# Altium project 10.08.2025.PrjPcb
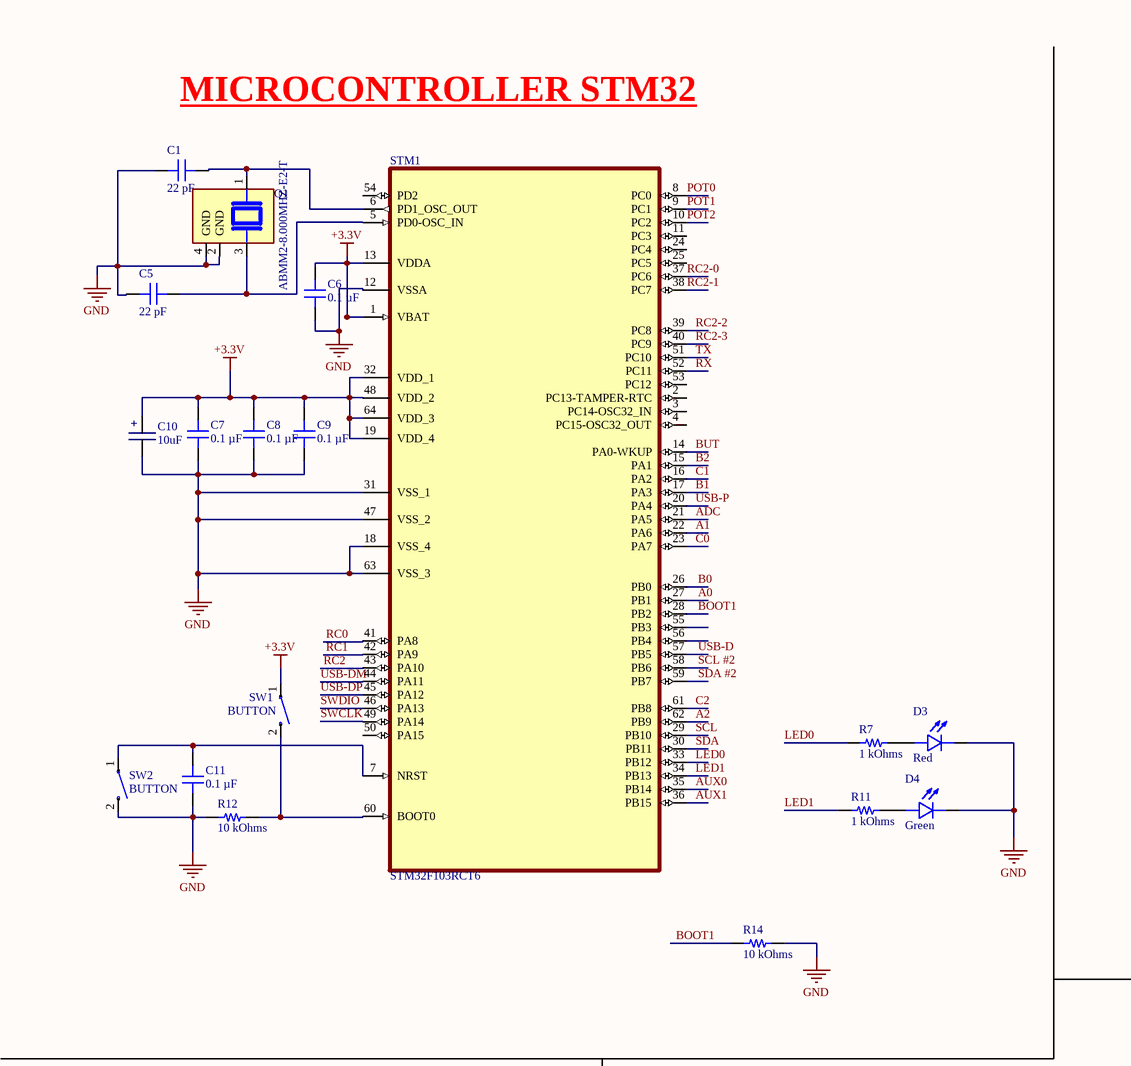
[diagram p0: Sheet2.SchDoc, top left]
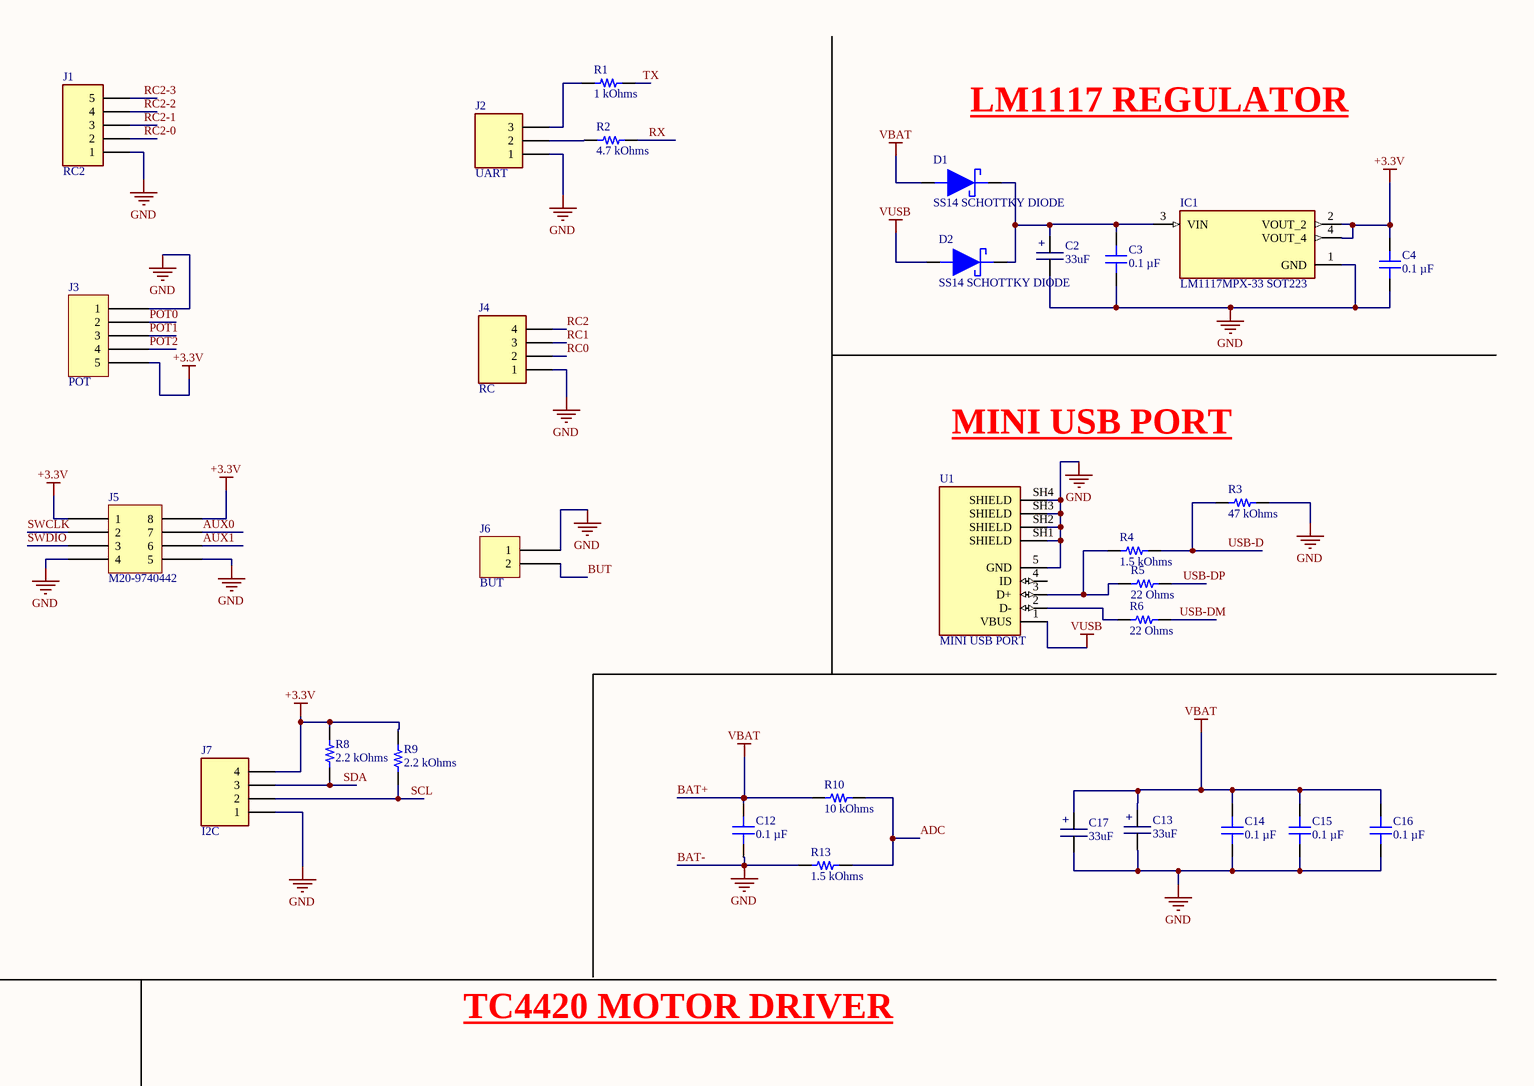
[diagram p1: Sheet2.SchDoc, top right]
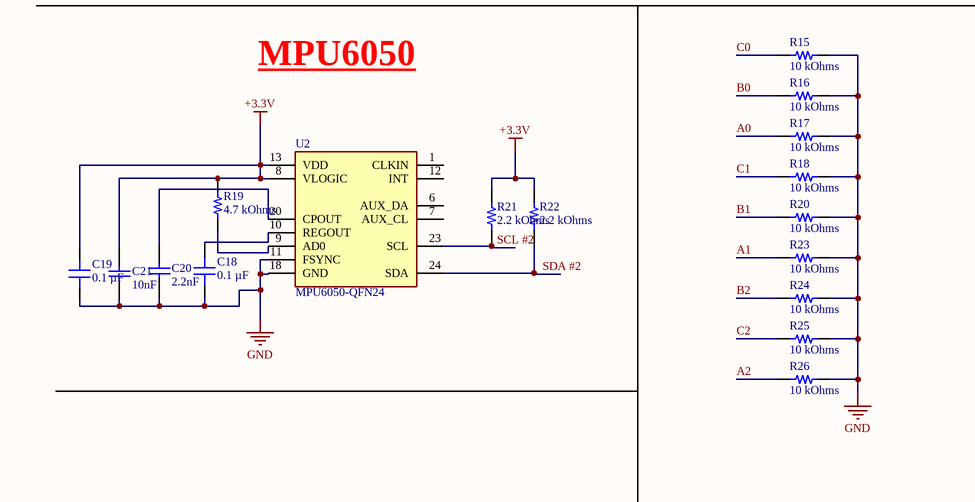
[diagram p2: Sheet2.SchDoc, bottom left]
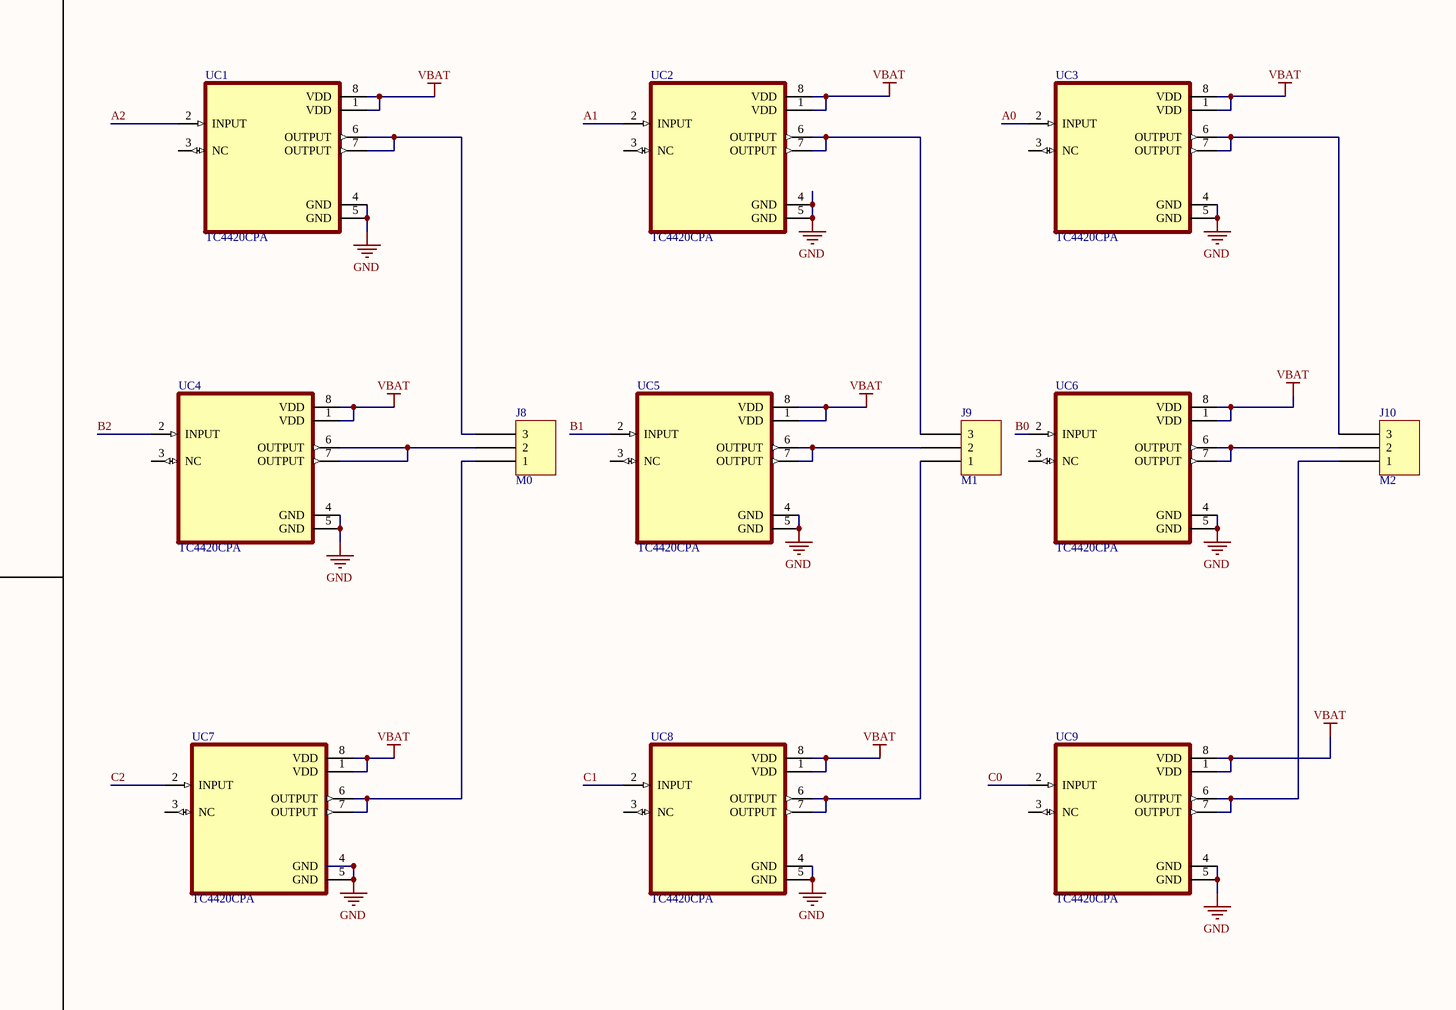
[diagram p3: Sheet2.SchDoc, bottom right]
1 sheet, 77 parts. Net scope: global (net labels, ports and power ports of the same name join across sheets).
Board file: PCB2.PcbDoc

## Sheet Sheet2.SchDoc
size 500 x 400 mm; SheetNumber: 1; SheetTotal: 1

### Parts
C1  22 pF  [CAP 1206_3216 - 0.8MM]
C2  33uF  [TANTAL CAP C-CASE]
C3  0.1 µF  [CAP 1206_3216 - 0.8MM]
C4  0.1 µF  [CAP 1206_3216 - 0.8MM]
C5  22 pF  [CAP 1206_3216 - 0.8MM]
C6  0.1 µF  [CAP 1206_3216 - 0.8MM]
C7  0.1 µF  [CAP 1206_3216 - 0.8MM]
C8  0.1 µF  [CAP 1206_3216 - 0.8MM]
C9  0.1 µF  [CAP 1206_3216 - 0.8MM]
C10  10uF  [TANTALUM SMD B]
C11  0.1 µF  [CAP 1206_3216 - 0.8MM]
C12  0.1 µF  [CAP 1206_3216 - 0.8MM]
C13  33uF  [TANTAL CAP C-CASE]
C14  0.1 µF  [CAP 1206_3216 - 0.8MM]
C15  0.1 µF  [CAP 1206_3216 - 0.8MM]
C16  0.1 µF  [CAP 1206_3216 - 0.8MM]
C17  33uF  [TANTAL CAP C-CASE]
C18  0.1 µF  [CAP 1206_3216 - 0.8MM]
C19  0.1 µF  [CAP 1206_3216 - 0.8MM]
C20  value 2.2nF  [CAP1206]  (hidden comment: CAP)
C21  value 10nF  [CAP1206]  (hidden comment: CAP)
D1  SS14 SCHOTTKY DIODE  [SS14 SCHOTTKY DIODE]
D2  SS14 SCHOTTKY DIODE  [SS14 SCHOTTKY DIODE]
D3  Red  [LEDC3216X120N]
D4  Green  [LEDC3216X120N]
IC1  LM1117MPX-33 SOT223  [LM1117MPX-33 SOT223]
J1  RC2  [header 5x1]
J2  UART  [HEADER 3PIN]
J3  POT  [HARWIN M20-9960545]
J4  RC  [Header 4pin]
J5  M20-9740442  [HARWIN M20-9740445]
J6  BUT  [HARWIN M20-9960245]
J7  I2C  [Header 4pin]
J8  M0  [HARWIN M20-9960345]
J9  M1  [HARWIN M20-9960345]
J10  M2  [HARWIN M20-9960345]
Q1  ABMM2-8.000MHZ-E2-T  [ABMM2-8.000MHZ-E2-T]
R1  1 kOhms  [RES 1206_3216]
R2  4.7 kOhms  [RES 1206_3216]
R3  47 kOhms  [YAGEO RES 1206_3216]
R4  1.5 kOhms  [RES 1206_3216]
R5  22 Ohms  [YAGEO RES 1206_3216]
R6  22 Ohms  [YAGEO RES 1206_3216]
R7  1 kOhms  [RES 1206_3216]
R8  2.2 kOhms  [YAGEO RES 1206_3216]
R9  2.2 kOhms  [YAGEO RES 1206_3216]
R10  10 kOhms  [RES 1206_3216]
R11  1 kOhms  [RES 1206_3216]
R12  10 kOhms  [RES 1206_3216]
R13  1.5 kOhms  [RES 1206_3216]
R14  10 kOhms  [RES 1206_3216]
R15  10 kOhms  [RES 1206_3216]
R16  10 kOhms  [RES 1206_3216]
R17  10 kOhms  [RES 1206_3216]
R18  10 kOhms  [RES 1206_3216]
R19  4.7 kOhms  [RES 1206_3216]
R20  10 kOhms  [RES 1206_3216]
R21  2.2 kOhms  [YAGEO RES 1206_3216]
R22  2.2 kOhms  [YAGEO RES 1206_3216]
R23  10 kOhms  [RES 1206_3216]
R24  10 kOhms  [RES 1206_3216]
R25  10 kOhms  [RES 1206_3216]
R26  10 kOhms  [RES 1206_3216]
STM1  STM32F103RCT6  [STM32F103RCT6]
SW1  BUTTON  [SW_1437566-3]
SW2  BUTTON  [SW_1437566-3]
U1  MINI USB PORT  [MINI USB PORT]
U2  MPU6050-QFN24  [MPU6050-QFN24]
UC1  TC4420CPA  [TC4420CPA]
UC2  TC4420CPA  [TC4420CPA]
UC3  TC4420CPA  [TC4420CPA]
UC4  TC4420CPA  [TC4420CPA]
UC5  TC4420CPA  [TC4420CPA]
UC6  TC4420CPA  [TC4420CPA]
UC7  TC4420CPA  [TC4420CPA]
UC8  TC4420CPA  [TC4420CPA]
UC9  TC4420CPA  [TC4420CPA]

### Nets
+3.3V: C4.1 C6.1 C7.1 C8.1 C9.1 C10.2 C19.1 C21.2 IC1.2(VOUT_2) IC1.4(VOUT_4) J3.5 J5.1 J5.8 J7.04(4) R8.1 R9.2 R19.1 R21.1 R22.1 STM1.1(VBAT) STM1.13(VDDA) STM1.19(VDD_4) STM1.32(VDD_1) STM1.48(VDD_2) STM1.64(VDD_3) SW1.1 U2.8(VLOGIC) U2.13(VDD)
BAT+: C12.1 C13.2 C14.1 C15.1 C16.1 C17.2 D1.2(A) R10.1 UC1.1(VDD) UC1.8(VDD) UC2.1(VDD) UC2.8(VDD) UC3.1(VDD) UC3.8(VDD) UC4.1(VDD) UC4.8(VDD) UC5.1(VDD) UC5.8(VDD) UC6.1(VDD) UC6.8(VDD) UC7.1(VDD) UC7.8(VDD) UC8.1(VDD) UC8.8(VDD) UC9.1(VDD) UC9.8(VDD)  [also labelled VBAT]
BAT-: C1.1 C2.1 C3.2 C4.2 C5.1 C6.2 C7.2 C8.2 C9.2 C10.1 C11.2 C12.2 C13.1 C14.2 C15.2 C16.2 C17.1 C18.2 C19.2 C20.1 C21.1 D3.NEG D4.NEG IC1.1(GND) J1.1 J2.1 J3.1 J4.01(1) J5.4 J5.5 J6.1 J7.01(1) Q1.2(GND) Q1.4(GND) R3.2 R12.1 R13.1 R14.2 R15.2 R16.2 R17.2 R18.2 R20.2 R23.2 R24.2 R25.2 R26.2 STM1.12(VSSA) STM1.18(VSS_4) STM1.31(VSS_1) STM1.47(VSS_2) STM1.63(VSS_3) SW2.2 U1.5(GND) U1.SH1(SHIELD) U1.SH2(SHIELD) U1.SH3(SHIELD) U1.SH4(SHIELD) U2.11(FSYNC) U2.18(GND) UC1.4(GND) UC1.5(GND) UC2.4(GND) UC2.5(GND) UC3.4(GND) UC3.5(GND) UC4.4(GND) UC4.5(GND) UC5.4(GND) UC5.5(GND) UC6.4(GND) UC6.5(GND) UC7.4(GND) UC7.5(GND) UC8.4(GND) UC8.5(GND) UC9.4(GND) UC9.5(GND)  [also labelled GND]
VUSB: D2.2(A) U1.1(VBUS)
A0: R17.1 STM1.27(PB1) UC3.2(INPUT)
A1: R23.1 STM1.22(PA6) UC2.2(INPUT)
A2: R26.1 STM1.62(PB9) UC1.2(INPUT)
ADC: R10.2 R13.2 STM1.21(PA5)
AUX0: J5.7 STM1.35(PB14)
AUX1: J5.6 STM1.36(PB15)
B0: R16.1 STM1.26(PB0) UC6.2(INPUT)
B1: R20.1 STM1.17(PA3) UC5.2(INPUT)
B2: R24.1 STM1.15(PA1) UC4.2(INPUT)
BOOT1: R14.1 STM1.28(PB2)
BUT: J6.2 STM1.14(PA0-WKUP)
C0: R15.1 STM1.23(PA7) UC9.2(INPUT)
C1: R18.1 STM1.16(PA2) UC8.2(INPUT)
C2: R25.1 STM1.61(PB8) UC7.2(INPUT)
LED0: R7.1 STM1.33(PB12)
LED1: R11.1 STM1.34(PB13)
POT0: J3.2 STM1.8(PC0)
POT1: J3.3 STM1.9(PC1)
POT2: J3.4 STM1.10(PC2)
RC0: J4.02(2) STM1.41(PA8)
RC1: J4.03(3) STM1.42(PA9)
RC2: J4.04(4) STM1.43(PA10)
RC2-0: J1.2 STM1.37(PC6)
RC2-1: J1.3 STM1.38(PC7)
RC2-2: J1.4 STM1.39(PC8)
RC2-3: J1.5 STM1.40(PC9)
RX: R2.2 STM1.52(PC11)
SCL: J7.02(2) R9.1 STM1.29(PB10)
SCL #2: R21.2 STM1.58(PB6) U2.23(SCL)
SDA: J7.03(3) R8.2 STM1.30(PB11)
SDA #2: R22.2 STM1.59(PB7) U2.24(SDA)
SWCLK: J5.2 STM1.49(PA14)
SWDIO: J5.3 STM1.46(PA13)
TX: R1.2 STM1.51(PC10)
USB-D: R3.1 R4.2 STM1.57(PB5)
USB-DM: R6.2 STM1.44(PA11)
USB-DP: R5.2 STM1.45(PA12)
USB-P: STM1.20(PA4)
NetC1_2: C1.2 Q1.1 STM1.6(PD1_OSC_OUT)
NetC2_2: C2.2 C3.1 D1.1(K) D2.1(K) IC1.3(VIN)
NetC5_2: C5.2 Q1.3 STM1.5(PD0-OSC_IN)
NetC11_1: C11.1 STM1.7(NRST) SW2.1
NetC18_1: C18.1 U2.10(REGOUT)
NetC20_2: C20.2 U2.20(CPOUT)
NetD3_POS: D3.POS R7.2
NetD4_POS: D4.POS R11.2
NetJ2_2: J2.2 R2.1
NetJ2_3: J2.3 R1.1
NetJ8_1: J8.1 UC7.6(OUTPUT) UC7.7(OUTPUT)
NetJ8_2: J8.2 UC4.6(OUTPUT) UC4.7(OUTPUT)
NetJ8_3: J8.3 UC1.6(OUTPUT) UC1.7(OUTPUT)
NetJ9_1: J9.1 UC8.6(OUTPUT) UC8.7(OUTPUT)
NetJ9_2: J9.2 UC5.6(OUTPUT) UC5.7(OUTPUT)
NetJ9_3: J9.3 UC2.6(OUTPUT) UC2.7(OUTPUT)
NetJ10_1: J10.1 UC9.6(OUTPUT) UC9.7(OUTPUT)
NetJ10_2: J10.2 UC6.6(OUTPUT) UC6.7(OUTPUT)
NetJ10_3: J10.3 UC3.6(OUTPUT) UC3.7(OUTPUT)
NetR4_1: R4.1 R5.1 U1.3(D+)
NetR6_1: R6.1 U1.2(D-)
NetR12_2: R12.2 STM1.60(BOOT0) SW1.2
NetR19_2: R19.2 U2.9(AD0)

Not connected (* = marked no-connect by the designer): STM1 2(PC13-TAMPER-RTC) 3(PC14-OSC32_IN) 4(PC15-OSC32_OUT) 11(PC3) 24(PC4) 25(PC5) 50(PA15) 53(PC12) 54(PD2) 55(PB3) 56(PB4); U1 4(ID); U2 1(CLKIN) 6(AUX_DA) 7(AUX_CL) 12(INT); UC1 3(NC); UC2 3(NC); UC3 3(NC); UC4 3(NC); UC5 3(NC); UC6 3(NC); UC7 3(NC); UC8 3(NC); UC9 3(NC)

### Notes on the sheet
- MICROCONTROLLER STM32
- LM1117 REGULATOR
- MINI USB PORT
- TC4420 MOTOR DRIVER
- MPU6050
- (in symbol TANTAL CAP C-CASE) +
- (in symbol TANTALUM SMD B) +

### Library data of the parts
C1 C5 = CC1206JRNPO9BN220: CAP CER 22PF 50V C0G/NPO 1206; manufacturer: Yageo; Temperature Coefficient: C0G, NP0; Tolerance: ±5%; Part Number: CC1206JRNPO9BN220; Capacitance: 22 pF; Applications: General Purpose; componentlink1description: Datasheet; componentlink1url: https://www.yageo.com/upload/media/product/productsearch/datasheet/mlcc/UPY-GP_NP0_16V-to-50V_17.pdf; componentlink2description: DigiKey Link; componentlink2url: https://www.digikey.com/en/products/detail/yageo/CC1206JRNPO9BN220/302888; Device Package: 1206 (3216 Metric); lastupdated: 4.06.2024 19:10:37; Lifecycle Status: Active; Minimum Order: 1; Mounting Type: Surface Mount, MLCC; Operating Temperature: -55°C ~ 125°C; Package / Case: 1206 (3216 Metric); packaging: TapeAndReel; partid: 18729; Part Status: Active; price: 0.03; series: CC; Size / Dimension: 0.126" L x 0.063" W (3.20mm x 1.60mm); Supplier 1: DigiKey; Supplier Part Number 1: 311-1154-1-ND; Thickness (Max): 0.024" (0.60mm); value: 22 pF; Voltage - Rated: 50V
C2 C13 C17 = TANTAL CAP C-CASE
C3 C4 C6-C9 C11 C12 C14-C16 C18 C19 = 1206B104J101N: MLCC 1206 100V 100NF X7R; manufacturer: Knowles Novacap; Tolerance: ±5%; Part Number: 1206B104J101N; Capacitance: 0.1 µF; Applications: SMPS Filtering; componentlink1description: Datasheet; componentlink1url: https://www.knowlescapacitors.com/getattachment/ddd08fe0-16c1-4f86-944e-edc3fc04fb57/X7R.pdf; componentlink2description: DigiKey Link; componentlink2url: https://www.digikey.com/en/products/detail/knowles-novacap/1206B104J101N/22208472; Device Package: 1206 (3216 Metric); lastupdated: 4.06.2024 19:09:54; Lifecycle Status: Active; Minimum Order: 1; Mounting Type: Surface Mount, MLCC; Operating Temperature: -55°C ~ 125°C; Package / Case: 1206 (3216 Metric); packaging: Bulk; partid: 59278; price: 0.25; series: -; Size / Dimension: 0.126" L x 0.063" W (3.20mm x 1.60mm); Supplier 1: DigiKey; Supplier Part Number 1: 1763-1206B104J101N-ND; Temperature Coefficient: X7R; Thickness (Max): 0.064" (1.63mm); value: 0.1 µF; Voltage - Rated: 100V
C10 = TANTALUM SMD B: Generic Tantalum Type B, 3.5x2.8x1.9.
C20 = CAP-SM-1206-X7R-10uF-50V: 2.2nF; Manufacturer: GENERIC; Part Number: CAP-SM-1206-X7R-10uF-50V; Package: 1206
C21 = CAP-SM-1206-X7R-10uF-50V: 10nF; Manufacturer: GENERIC; Part Number: CAP-SM-1206-X7R-10uF-50V; Package: 1206
D3 D4 = LHN974_RED_LED_1206: 2.6 V Red LED SMD; MF: Osram; MP: LHN974 RED LED 1206; SnapEDA_Link: https://www.snapeda.com/parts/LHN974%20RED%20LED%201206/Osram/view-part/?ref=snap; Package: None; Value: *; Check_prices: https://www.snapeda.com/parts/LHN974%20RED%20LED%201206/Osram/view-part/?ref=eda
J1 = header 5x1
J2 = Header 3pin
J3 = M20-9960545: CONN HEADER R/A 5POS 2.54MM; Manufacturer: Harwin Inc.; Connector Type: Header, Cuttable; Contact Length - Mating: 0.240" (6.10mm); Contact Length - Post: 0.118" (3.00mm); Current Rating (Amps): 3A per Contact; Material Flammability Rating: UL94 V-0; Number of Positions: 5; Number of Positions Loaded: All; Pitch - Mating: 0.100" (2.54mm); Row Spacing - Mating: -40°C ~ 105°C; Shrouding: Unshrouded; Style: Board to Board or Cable; Part Number: M20-9960545; ComponentLink1Description: Datasheet; ComponentLink1URL: https://cdn.harwin.com/pdfs/Harwin_PC_Connectors_M20.pdf; ComponentLink2Description: DigiKey Link; ComponentLink2URL: https://www.digikey.com/en/products/detail/harwin-inc/M20-9960545/3728210; Contact Finish - Mating: Gold; Contact Material: Brass; Contact Shape: Square; Contact Type: Male Pin; Fastening Type: Push-Pull; Insulation Color: Black; Insulation Height: 0.100" (2.54mm); Insulation Material: Polyamide (PA6T), Nylon 6T; LastUpdated: 21.09.2022 19:23:36; Lifecycle Status: Active; Minimum Order: 1; Mounting Type: Through Hole, Right Angle; Number of Rows: 1; Operating Temperature: -40°C ~ 105°C; Packaging: Bulk; PartId: 168; Part Status: Active; Price: 0.14; Series: M20; Supplier 1: DigiKey; Supplier Part Number 1: 952-2246-ND; Termination: Solder
J4 J7 = Header 4pin
J5 = M20-9740442: CONN HEADER R/A 8POS 2.54MM; Manufacturer: Harwin Inc.; Connector Type: Header, Cuttable; Current Rating (Amps): 3A per Contact; Material Flammability Rating: UL94 V-0; Number of Positions: 8; Number of Positions Loaded: All; Shrouding: Unshrouded; Style: Board to Board or Cable; Part Number: M20-9740442; ComponentLink1Description: Datasheet; ComponentLink1URL: https://cdn.harwin.com/pdfs/M20-974.pdf; ComponentLink2Description: DigiKey Link; ComponentLink2URL: http://digikey.com/product-detail/en/harwin-inc/M20-9740442/M20-9740442-ND/3920714; Contact Finish - Mating: Gold; Contact Finish - Post: Tin; Contact Material: Brass; Contact Shape: Square; Contact Type: Male Pin; Fastening Type: Push-Pull; Insulation Color: Black; Insulation Material: Polyamide (PA6T), Nylon 6T; LastUpdated: 21.09.2022 19:17:53; Lifecycle Status: Active; Minimum Order: 5000; Mounting Type: Through Hole, Right Angle; Number of Rows: 2; Operating Temperature: -40°C ~ 105°C; Packaging: Bulk; PartId: 157; Part Status: Active; Price: 0.18; Series: M20; Supplier 1: DigiKey; Supplier Part Number 1: M20-9740442-ND; Termination: Solder
J6 = M20-9960245: CONN HEADER R/A 2POS 2.54MM; Manufacturer: Harwin Inc.; Connector Type: Header, Cuttable; Contact Length - Mating: 0.240" (6.10mm); Contact Length - Post: 0.118" (3.00mm); Current Rating (Amps): 3A per Contact; Material Flammability Rating: UL94 V-0; Number of Positions: 2; Number of Positions Loaded: All; Pitch - Mating: 0.100" (2.54mm); Row Spacing - Mating: -40°C ~ 105°C; Shrouding: Unshrouded; Style: Board to Board or Cable; Part Number: M20-9960245; ComponentLink1Description: Datasheet; ComponentLink1URL: https://cdn.harwin.com/pdfs/Harwin_PC_Connectors_M20.pdf; ComponentLink2Description: DigiKey Link; ComponentLink2URL: https://www.digikey.com/en/products/detail/harwin-inc/M20-9960245/3728208; Contact Finish - Mating: Gold; Contact Material: Brass; Contact Shape: Square; Contact Type: Male Pin; Fastening Type: Push-Pull; Insulation Color: Black; Insulation Height: 0.100" (2.54mm); Insulation Material: Polyamide (PA6T), Nylon 6T; LastUpdated: 21.09.2022 19:22:55; Lifecycle Status: Active; Minimum Order: 1; Mounting Type: Through Hole, Right Angle; Number of Rows: 1; Operating Temperature: -40°C ~ 105°C; Packaging: Bulk; PartId: 165; Part Status: Active; Price: 0.07; Series: M20; Supplier 1: DigiKey; Supplier Part Number 1: 952-2244-ND; Termination: Solder
J8-J10 = M20-9960345: CONN HEADER R/A 3POS 2.54MM; Manufacturer: Harwin Inc.; Connector Type: Header, Cuttable; Contact Length - Mating: 0.240" (6.10mm); Contact Length - Post: 0.118" (3.00mm); Current Rating (Amps): 3A per Contact; Material Flammability Rating: UL94 V-0; Number of Positions: 3; Number of Positions Loaded: All; Pitch - Mating: 0.100" (2.54mm); Row Spacing - Mating: -40°C ~ 105°C; Shrouding: Unshrouded; Style: Board to Board or Cable; Part Number: M20-9960345; ComponentLink1Description: Datasheet; ComponentLink1URL: https://cdn.harwin.com/pdfs/Harwin_PC_Connectors_M20.pdf; ComponentLink2Description: DigiKey Link; ComponentLink2URL: https://www.digikey.com/en/products/detail/harwin-inc/M20-9960345/3728209; Contact Finish - Mating: Gold; Contact Material: Brass; Contact Shape: Square; Contact Type: Male Pin; Fastening Type: Push-Pull; Insulation Color: Black; Insulation Height: 0.100" (2.54mm); Insulation Material: Polyamide (PA6T), Nylon 6T; LastUpdated: 21.09.2022 19:23:07; Lifecycle Status: Active; Minimum Order: 1; Mounting Type: Through Hole, Right Angle; Number of Rows: 1; Operating Temperature: -40°C ~ 105°C; Packaging: Bulk; PartId: 166; Part Status: Active; Price: 0.09; Series: M20; Supplier 1: DigiKey; Supplier Part Number 1: 952-2245-ND; Termination: Solder
R1 R7 R11 = RNCS1206BKE1K00: RES 1K OHM 0.1% 1/8W 1206; Manufacturer: Stackpole Electronics Inc; Power (Watts): 0.125W, 1/8W; Temperature Coefficient: ±25ppm/°C; Part Number: RNCS1206BKE1K00; ComponentLink1Description: Datasheet; ComponentLink1URL: https://www.seielect.com/catalog/sei-rncs_rnch.pdf; ComponentLink2Description: DigiKey Link; ComponentLink2URL: https://www.digikey.com/en/products/detail/stackpole-electronics-inc/RNCS1206BKE1K00/1800333; Composition: Thin Film; Device Package: 1206 (3216 Metric); Features: Anti-Corrosive, Automotive AEC-Q200, Moisture Resistant; Height - Seated (Max): 0.026" (0.65mm); LastUpdated: 9.02.2024 20:54:46; Lifecycle Status: Active; Minimum Order: 1; Number of Terminations: 2; Operating Temperature: -55°C ~ 155°C; Package / Case: 1206 (3216 Metric); Packaging: TapeAndReel; PartId: 26856; Part Status: Active; Price: 0.08; Ratings: AEC-Q200; Resistance: 1 kOhms; Series: RNCS; Size / Dimension: 0.120" L x 0.061" W (3.05mm x 1.55mm); Supplier 1: DigiKey; Supplier Part Number 1: RNCS1206BKE1K00CT-ND; Supplier Device Package: 1206; Tolerance: ±0.1%; Value: 1 kOhms
R2 R19 = CRG1206F4K7: RES SMD 4.7K OHM 1% 1/4W 1206; Manufacturer: TE Connectivity Passive Product; Power (Watts): 0.25W, 1/4W; Temperature Coefficient: ±100ppm/°C; Part Number: CRG1206F4K7; ComponentLink1Description: Datasheet; ComponentLink1URL: https://www.te.com/commerce/DocumentDelivery/DDEController?Action=srchrtrv&DocNm=1773204&DocType=DS&DocLang=English; ComponentLink2Description: DigiKey Link; ComponentLink2URL: https://www.digikey.com/en/products/detail/te-connectivity-passive-product/CRG1206F4K7/2381014; Composition: Thick Film; Device Package: 1206 (3216 Metric); Height - Seated (Max): 0.026" (0.65mm); LastUpdated: 9.02.2024 20:54:45; Lifecycle Status: Active; Minimum Order: 1; Number of Terminations: 2; Operating Temperature: -55°C ~ 155°C; Package / Case: 1206 (3216 Metric); Packaging: TapeAndReel; PartId: 26987; Part Status: Active; Price: 0.01; Resistance: 4.7 kOhms; Series: CRG, Neohm; Size / Dimension: 0.122" L x 0.061" W (3.10mm x 1.55mm); Supplier 1: DigiKey; Supplier Part Number 1: A106078CT-ND; Supplier Device Package: 1206; Tolerance: ±1%; Value: 4.7 kOhms
R3 = RC1206JR-0747KL: RES 47K OHM 5% 1/4W 1206; Manufacturer: Yageo; Power (Watts): 0.25W, 1/4W; Temperature Coefficient: ±100ppm/°C; Part Number: RC1206JR-0747KL; ComponentLink1Description: Datasheet; ComponentLink1URL: https://www.yageo.com/upload/media/product/productsearch/datasheet/rchip/PYu-RC_Group_51_RoHS_L_10.pdf; ComponentLink2Description: DigiKey Link; ComponentLink2URL: https://www.digikey.com/en/products/detail/yageo/RC1206JR-0747KL/729303; Composition: Thick Film; Device Package: 1206 (3216 Metric); Features: Moisture Resistant; Height - Seated (Max): 0.026" (0.65mm); LastUpdated: 25.07.2024 09:21:36; Lifecycle Status: Active; Minimum Order: 1; Number of Terminations: 2; Operating Temperature: -55°C ~ 155°C; Package / Case: 1206 (3216 Metric); Packaging: TapeAndReel; PartId: 27912; Part Status: Active; Price: 0.01; Resistance: 47 kOhms; Series: RC_L; Size / Dimension: 0.122" L x 0.063" W (3.10mm x 1.60mm); Supplier 1: DigiKey; Supplier Part Number 1: 311-47KERCT-ND; Supplier Device Package: 1206; Tolerance: ±5%; Value: 47 kOhms
R4 R13 = RNCP1206FTD1K50: RES 1.5K OHM 1% 1/2W 1206; Manufacturer: Stackpole Electronics Inc; Power (Watts): 0.5W, 1/2W; Temperature Coefficient: ±100ppm/°C; Part Number: RNCP1206FTD1K50; ComponentLink1Description: Datasheet; ComponentLink1URL: https://www.seielect.com/catalog/sei-rncp.pdf; ComponentLink2Description: DigiKey Link; ComponentLink2URL: https://www.digikey.com/en/products/detail/stackpole-electronics-inc/RNCP1206FTD1K50/2240341; Composition: Thin Film; Device Package: 1206 (3216 Metric); Features: Anti-Sulfur; Height - Seated (Max): 0.025" (0.65mm); LastUpdated: 9.02.2024 20:54:45; Lifecycle Status: Active; Minimum Order: 1; Number of Terminations: 2; Operating Temperature: -55°C ~ 155°C; Package / Case: 1206 (3216 Metric); Packaging: TapeAndReel; PartId: 26971; Part Status: Active; Price: 0.01; Resistance: 1.5 kOhms; Series: RNCP; Size / Dimension: 0.122" L x 0.059" W (3.10mm x 1.50mm); Supplier 1: DigiKey; Supplier Part Number 1: RNCP1206FTD1K50CT-ND; Supplier Device Package: 1206; Tolerance: ±1%; Value: 1.5 kOhms
R5 R6 = AC1206JR-0722RL: RES SMD 22 OHM 5% 1/4W 1206; Manufacturer: Yageo; Power (Watts): 0.25W, 1/4W; Temperature Coefficient: ±100ppm/°C; Part Number: AC1206JR-0722RL; ComponentLink1Description: Datasheet; ComponentLink1URL: https://www.yageo.com/upload/media/product/productsearch/datasheet/rchip/PYu-AC_51_RoHS_L_7.pdf; ComponentLink2Description: DigiKey Link; ComponentLink2URL: https://www.digikey.com/en/products/detail/yageo/AC1206JR-0722RL/5897810; Composition: Thick Film; Device Package: 1206 (3216 Metric); Features: Automotive AEC-Q200, Moisture Resistant; Height - Seated (Max): 0.026" (0.65mm); LastUpdated: 25.07.2024 09:21:37; Lifecycle Status: Active; Minimum Order: 1; Number of Terminations: 2; Operating Temperature: -55°C ~ 155°C; Package / Case: 1206 (3216 Metric); Packaging: TapeAndReel; PartId: 27520; Part Status: Active; Price: 0.01; Ratings: AEC-Q200; Resistance: 22 Ohms; Series: AC; Size / Dimension: 0.122" L x 0.063" W (3.10mm x 1.60mm); Supplier 1: DigiKey; Supplier Part Number 1: YAG3939CT-ND; Supplier Device Package: 1206; Tolerance: ±5%; Value: 22 Ohms
R8 R9 R21 R22 = RT1206BRD072K2L: RES SMD 2.2K OHM 0.1% 1/4W 1206; Manufacturer: Yageo; Power (Watts): 0.25W, 1/4W; Temperature Coefficient: ±25ppm/°C; Part Number: RT1206BRD072K2L; ComponentLink1Description: Datasheet; ComponentLink1URL: https://www.yageo.com/upload/media/product/productsearch/datasheet/rchip/PYu-RT_1-to-0.01_RoHS_L_11.pdf; ComponentLink2Description: DigiKey Link; ComponentLink2URL: https://www.digikey.com/en/products/detail/yageo/RT1206BRD072K2L/1079707; Composition: Thin Film; Device Package: 1206 (3216 Metric); Height - Seated (Max): 0.026" (0.65mm); LastUpdated: 25.07.2024 09:21:38; Lifecycle Status: Active; Minimum Order: 1; Number of Terminations: 2; Operating Temperature: -55°C ~ 155°C; Package / Case: 1206 (3216 Metric); Packaging: TapeAndReel; PartId: 26874; Part Status: Active; Price: 0.09; Resistance: 2.2 kOhms; Series: RT; Size / Dimension: 0.122" L x 0.063" W (3.10mm x 1.60mm); Supplier 1: DigiKey; Supplier Part Number 1: YAG5058CT-ND; Supplier Device Package: 1206; Tolerance: ±0.1%; Value: 2.2 kOhms
R10 R12 R14-R18 R20 R23-R26 = CRG1206F10K: RES SMD 10K OHM 1% 1/4W 1206; Manufacturer: TE Connectivity Passive Product; Power (Watts): 0.25W, 1/4W; Temperature Coefficient: ±100ppm/°C; Part Number: CRG1206F10K; ComponentLink1Description: Datasheet; ComponentLink1URL: https://www.te.com/commerce/DocumentDelivery/DDEController?Action=srchrtrv&DocNm=1773204&DocType=DS&DocLang=English; ComponentLink2Description: DigiKey Link; ComponentLink2URL: https://www.digikey.com/en/products/detail/te-connectivity-passive-product/CRG1206F10K/2389909; Composition: Thick Film; Device Package: 1206 (3216 Metric); Height - Seated (Max): 0.026" (0.65mm); LastUpdated: 9.02.2024 20:54:44; Lifecycle Status: Active; Minimum Order: 1; Number of Terminations: 2; Operating Temperature: -55°C ~ 155°C; Package / Case: 1206 (3216 Metric); Packaging: TapeAndReel; PartId: 26989; Part Status: Active; Price: 0.01; Resistance: 10 kOhms; Series: CRG, Neohm; Size / Dimension: 0.122" L x 0.061" W (3.10mm x 1.55mm); Supplier 1: DigiKey; Supplier Part Number 1: A106069CT-ND; Supplier Device Package: 1206; Tolerance: ±1%; Value: 10 kOhms
SW1 SW2 = RESET_BUTTON